# EAGLE design Optokoppleradapter_Spannungsmessung (EAGLE 6.1)
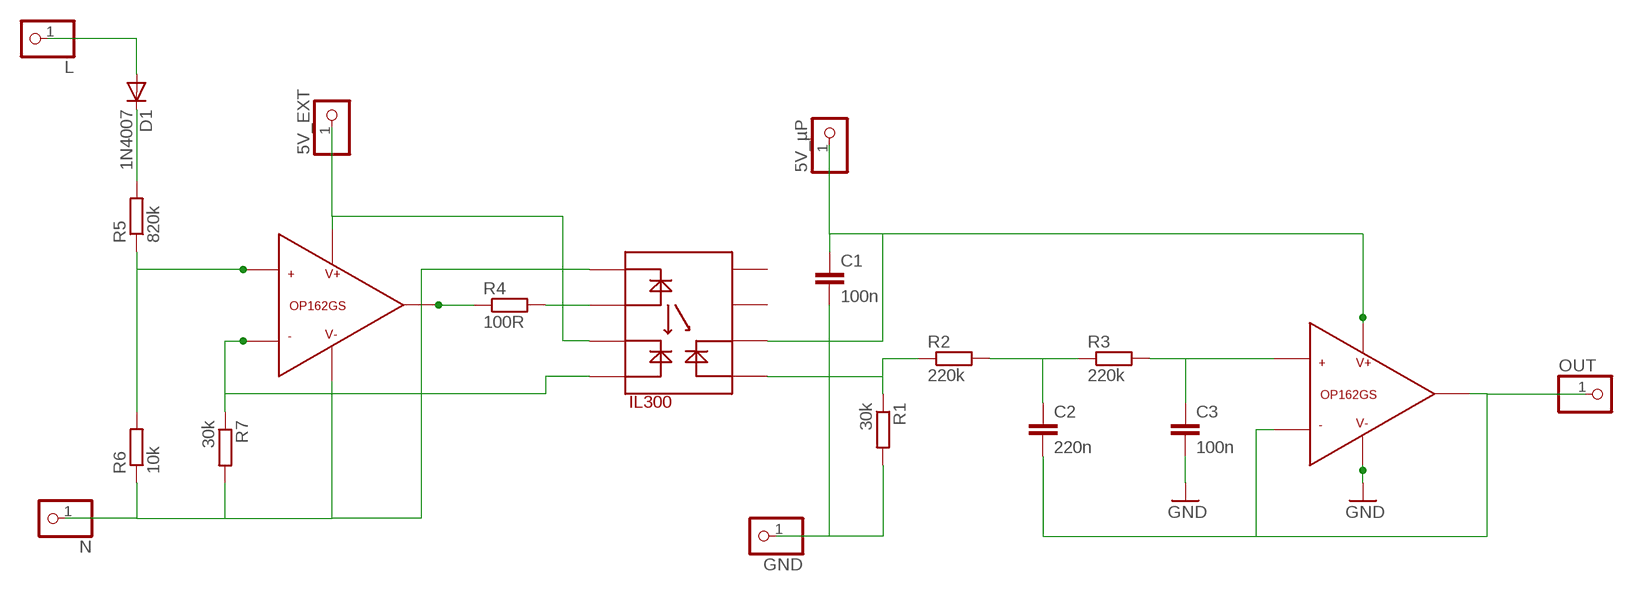
[diagram p0: schematic, sheet 1]

## Parts
5V_EXT  PINHD-1X1  [1X01]
5V_µP  PINHD-1X1  [1X01]
C1  100n  C-EUC0805  [C0805]
C2  220n  C-EUC0805  [C0805]
C3  100n  C-EUC0805  [C0805]
D1  1N4007  1N4148DO35-7  [DO35-7]
GND  PINHD-1X1  [1X01]
L  PINHD-1X1  [1X01]
N  PINHD-1X1  [1X01]
OUT  PINHD-1X1  [1X01]
R1  30k  R-EU_R0805  [R0805]
R2  220k  R-EU_R0805  [R0805]
R3  220k  R-EU_R0805  [R0805]
R4  100R  R-EU_R0805  [R0805]
R5  820k  R-EU_0207/7  [0207/7]
R6  10k  R-EU_0207/7  [0207/7]
R7  30k  R-EU_0207/7  [0207/7]
U$1  IL300  [DIP8]
U$2  OP162GS  [SOIC_N]
U$3  OP162GS  [SOIC_N]

## Nets
5V_EXTERN: 5V_EXT.1 U$1.P$3 U$2.P$7(V+)
5V_µP: 5V_µP.1 C1.1 U$1.P$6 U$3.P$7(V+)
ADC: C2.2 OUT.1 U$3.P$2(-) U$3.P$6(OUT)
GND: C1.2 C3.2 GND.1 R1.2 U$3.P$4(V-)
L: D1.A L.1
N: N.1 R6.1 R7.2 U$1.P$1 U$2.P$4(V-)
N$1: D1.C R5.2
N$2: R5.1 R6.2 U$2.P$3(+)
N$4: R7.1 U$1.P$4 U$2.P$2(-)
N$5: R4.1 U$2.P$6(OUT)
N$6: R4.2 U$1.P$2
N$10: R1.1 R2.1 U$1.P$5
N$11: C2.1 R2.2 R3.1
N$12: C3.1 R3.2 U$3.P$3(+)
Unconnected: U$1.P$7 U$1.P$8

## Library data of the parts
5V_EXT 5V_µP GND L N OUT = pinhead:PINHD-1X1: PIN HEADER
C1-C3 = resistor:C-EU: CAPACITOR, European symbol
D1 = diode:1N4148: DIODE high speed (Philips)
R1-R7 = resistor:R-EU_: RESISTOR, European symbol
U$1 = ADS:IL300
U$2 U$3 = ADS:OP162GS

## Board
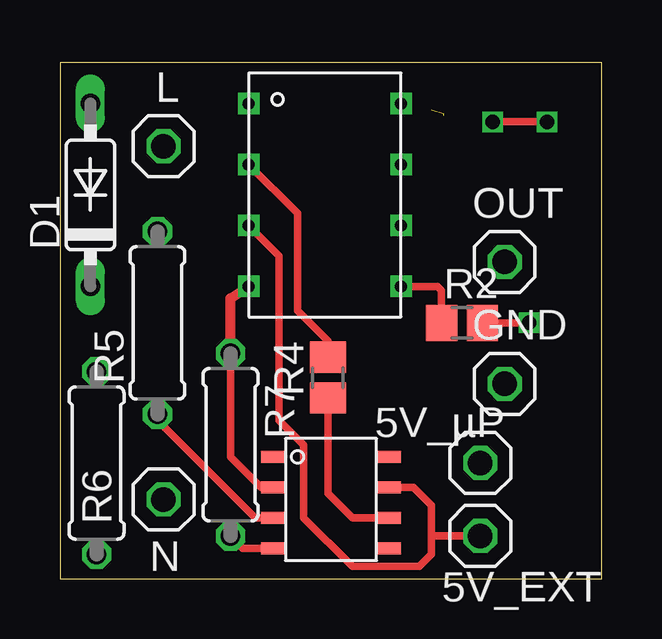
[diagram p1: board, top side]
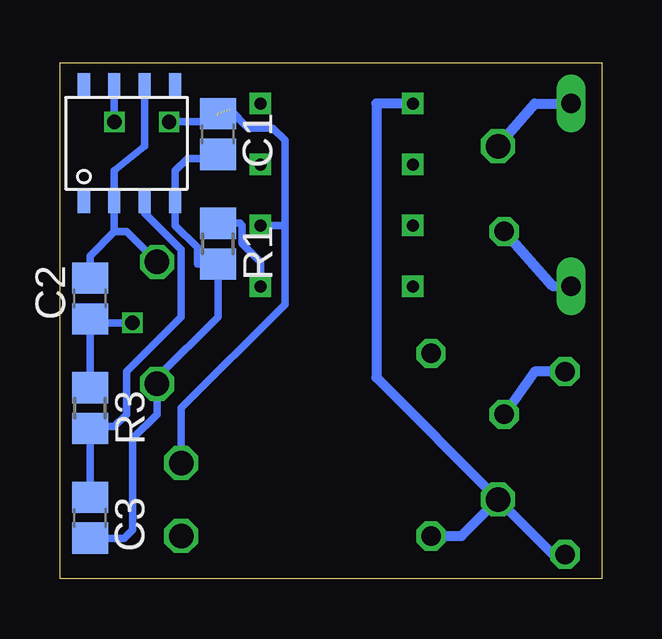
[diagram p2: board, bottom side, seen from below]

Size 22.59 x 21.51 mm. Coordinates in mm from the lower left corner, seen from the top.
Outline: 0,0 22.59,0 22.59,21.51 0,21.51 0,0
Copper layers (1*16): Top 0.035mm / dielectric 1.5mm / Bottom 0.035mm
Design rules: minimum track width 0.125mm, minimum drill 0.2mm, track to track 0.125mm, track to pad 0.125mm, pad to pad 0.125mm, via to via 0.125mm, smd to smd 0.125mm, copper to edge 0.3mm, drill to drill 0.2mm, minimum pad ring 0.2mm, minimum via ring 0.125mm, stop-mask expansion 0.075mm, vias tented up to drill 0mil, thermal gap 0.2mm

### Footprints (pad centres in the part's own frame; a part is rotated, then mirrored left to right if it is on the bottom)
1X01 = drill 1.016 octagon: 1 0,0
C0805 = smd 1.3 x 1.5: 1 -0.85,0; 2 0.85,0
DO35-7 = drill 0.813 long: A 3.81,0; C -3.81,0
R0805 = smd 1.3 x 1.5: 1 -0.85,0; 2 0.85,0
0207/7 = drill 0.813 octagon: 1 -3.81,0; 2 3.81,0
DIP8 = drill 0.5 square: P$1 0,8.89; P$2 0,6.35; P$3 0,3.81; P$4 0,1.27; P$5 6.35,1.27; P$6 6.35,3.81; P$7 6.35,6.35; P$8 6.35,8.89
SOIC_N = smd 1.016 x 0.508: P$1 -0.508,4.318; P$2 -0.508,3.048; P$3 -0.508,1.778; P$4 -0.508,0.508; P$5 4.318,0.508; P$6 4.318,1.778; P$7 4.318,3.048; P$8 4.318,4.318

### Placement (x,y rotation side)
5V_EXT  17.53,1.78 0 top
5V_µP  17.53,4.83 0 top
C1  16,18.54 270 bottom
C2  21.34,11.68 90 bottom
C3  21.34,2.54 270 bottom
D1  1.27,16 90 top
GND  18.54,8.13 0 top
L  4.32,18.03 0 top
N  4.32,3.3 0 top
OUT  18.54,13.21 0 top
R1  16,13.97 270 bottom
R2  16.76,10.67 0 top
R3  21.34,7.11 270 bottom
R4  11.18,8.38 90 top
R5  4.06,10.67 90 top
R6  1.52,4.83 90 top
R7  7.11,5.59 270 top
U$1  7.87,10.92 0 top
U$2  9.4,0.76 0 top
U$3  17.27,16.26 90 bottom

### Tracks (layer width: path | path; a pad name or v marks a point on that pad's centre or on a via)
5V_EXTERN
  Top 0.305: 5V_EXT.1 15.49,1.78 | 15.49,1.78 15.49,1.02 14.99,0.51 12.19,0.51 10.16,2.54 10.16,5.59 9.14,6.6 9.14,13.46 U$1.P$3 | U$2.P$7 14.73,3.81 15.49,3.05 15.49,1.78
5V_µP  (via drill 0.6)  (2 unrouted)
  Top 0.305: v20.32,19.05 v18.03,19.05
  Bottom 0.305: U$1.P$6 13.21,14.73 | 13.21,14.73 13.21,18.29 13.72,18.8 14.73,18.8 15.49,19.56 | U$3.P$7 v20.32,19.05 | v18.03,19.05 16,19.05 16,19.3 | 5V_µP.1 17.53,7.11 13.21,11.43 13.21,14.73
ADC
  Bottom 0.305: U$3.P$6 19.05,18.03 20.32,17.02 U$3.P$2 20.32,14.48 | C2.2 21.34,13.46 20.32,14.48 | 20.32,14.48 19.81,14.48 OUT.1
GND
  Bottom 0.305: C3.2 19.9,1.69 19.56,2.03 19.56,5.84 18.54,6.86 GND.1 18.54,8.38 16,10.92 R1.2 16.85,13.12 16.85,13.8 17.78,14.73 U$3.P$4 17.78,17.02 17.27,17.53 16.17,17.53 C1.2
L
  Bottom 0.406: L.1 2.79,19.81 D1.A
N
  Top 0.305: U$2.P$4 7.62,1.27 R7.2
  Bottom 0.406: R6.1 2.03,1.02 N.1 | R7.2 5.84,1.78 N.1 | U$1.P$1 9.4,19.81 9.4,8.38 N.1
N$1
  Bottom 0.406: D1.C 2.03,12.19 R5.2
N$2
  Top 0.305: U$2.P$3 8.13,2.54 4.32,6.35 4.32,6.6 R5.1
  Bottom 0.406: R6.2 2.79,8.64 R5.1
N$4
  Top 0.305: U$2.P$2 8.38,3.81 7.11,5.08 R7.1
  Top 0.406: R7.1 7.11,11.68 U$1.P$4
N$5
  Top 0.305: U$2.P$6 12.19,2.54 11.18,3.56 R4.1
N$6
  Top 0.305: U$1.P$2 9.91,15.24 9.91,11.18 11.18,9.91 R4.2
N$10
  Top 0.305: R2.1 15.91,12.03 15.75,12.19 U$1.P$5
  Bottom 0.305: R1.1 15.07,14.82 14.99,14.73 14.99,13.97 14.22,13.21 U$1.P$5
N$11  (via drill 0.6)
  Top 0.305: R2.2 v19.56,10.67
  Bottom 0.305: R3.1 C2.1 | 21.25,10.92 C2.1 | v19.56,10.67 21.17,10.67 C2.1
N$12
  Bottom 0.305: C3.1 R3.2 | R3.2 21.34,6.35 | R3.2 21.25,6.35 20.32,6.35 19.81,6.86 19.81,8.64 17.53,10.92 17.53,13.72 19.05,15.24 U$3.P$3